# EAGLE design mainboard (EAGLE 8.1.1)
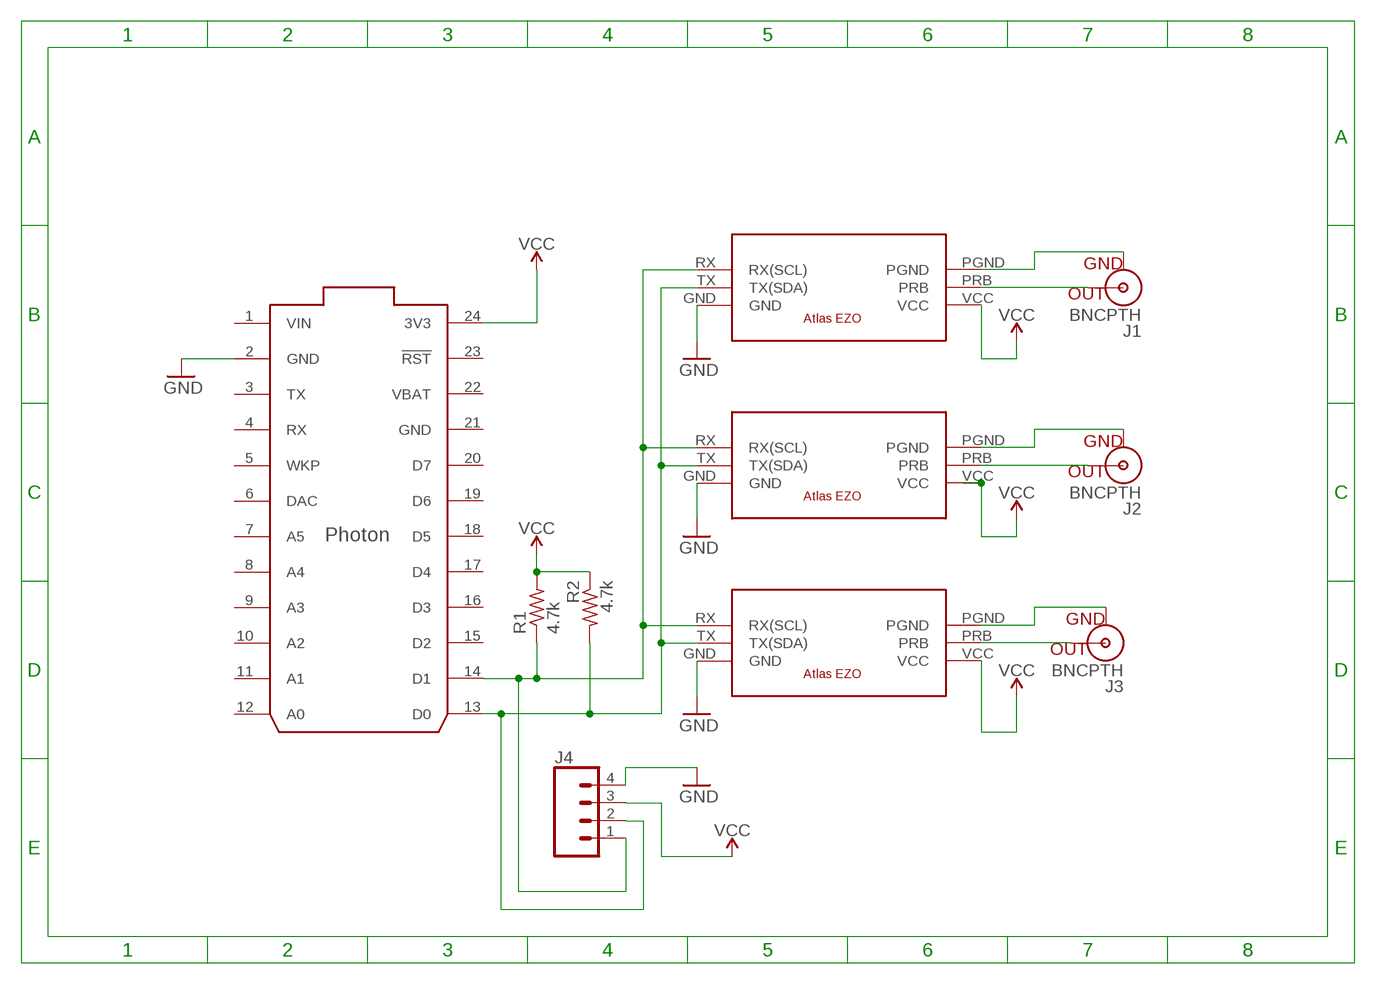
[diagram p0: schematic, sheet 1]

## Parts
J1  BNCPTH  [BNC]
J2  BNCPTH  [BNC]
J3  BNCPTH  [BNC]
J4  CONN_04  [1X04]
R1  4.7k  R-US_0207/7  [0207/7]
R2  4.7k  R-US_0207/7  [0207/7]
U$1  PHOTON_SMD  [PHOTON_SMD]
U$2  ATLSCI_EZO  [ATLAS_SCI_EZO]
U$3  ATLSCI_EZO  [ATLAS_SCI_EZO]
U$4  ATLSCI_EZO  [ATLAS_SCI_EZO]

## Nets
GND: J4.4 U$1.2(GND) U$2.GND U$3.GND U$4.GND
N$2: J4.1 R1.1 U$1.14(D1) U$2.RX(RX(SCL)) U$3.RX(RX(SCL)) U$4.RX(RX(SCL))
N$3: J4.2 R2.2 U$1.13(D0) U$2.TX(TX(SDA)) U$3.TX(TX(SDA)) U$4.TX(TX(SDA))
N$7: J2.S(OUT) U$3.PRB
N$8: J2.GND U$3.PGND
N$9: J1.S(OUT) U$2.PRB
N$10: J1.GND U$2.PGND
N$11: J3.S(OUT) U$4.PRB
N$12: J3.GND U$4.PGND
VCC: J4.3 R1.2 R2.1 U$1.24(3V3) U$2.VCC U$3.VCC U$4.VCC
Unconnected: U$1.3(TX) U$1.4(RX) U$1.5(WKP) U$1.6(DAC) U$1.7(A5) U$1.8(A4) U$1.9(A3) U$1.10(A2) U$1.11(A1) U$1.12(A0) U$1.15(D2) U$1.16(D3) U$1.17(D4) U$1.18(D5) U$1.19(D6) U$1.20(D7) U$1.23(!RST) U$1.25(EN) U$1.26(!SETUP) U$1.27(RGB_RED) U$1.28(RGB_GREEN) U$1.29(RGB_BLUE) U$1.30(USB_D-) U$1.31(USB_D+)

## Power pins joined to a net without a drawn wire
GND: U$1.21(GND)
VBAT: U$1.22(VBAT)
VIN: U$1.1(VIN)

## Library data of the parts
J1-J3 = SparkFun-Connectors:BNC: BNC Right Angle Connector Mouser Part# 5227161 SparkFun Products: BNC Connector - Right Angle <https://www.sparkfun.com/products/10550>; PROD_ID: LPA-12729; SF_ID: PRT-10550
J4 = SparkFun-Connectors:CONN_04: Multi connection point. Often used as Generic Header-pin footprint for 0.1 inch spaced/style header connections On any of the 0.1 inch spaced packages, you can populate with these: Break Away Headers - Straight <https://www.sparkfun.com/products/116> (PRT-00116) Break Away Male Headers - Right Angle <https://www.sparkfun.com/products/553> (PRT-00553) Female Headers <https://www.sparkfun.com/products/115> (PRT-00115) Break Away Headers - Machine Pin <https://www.sparkfun.com/products/117> (PRT-00117) Break Away Female Headers - Swiss Machine Pin <https://www.sparkfun.com/products/743> (PRT-00743) For SCREWTERMINALS and SPRING TERMINALS visit here: Screw Terimnals on SparkFun.com <https://www.sparkfun.com/search/results?term=Screw+Terminals> (5mm/3.5mm/2.54mm spacing) This device is also useful as a general connection point to wire up your design to another part of your project. Our various solder wires solder well into these plated through hole pads. Hook-Up Wire - Assortment (Stranded, 22 AWG) <https://www.sparkfun.com/products/11375> (PRT-11375) Hook-Up Wire - Assortment (Solid Core, 22 AWG) <https://www.sparkfun.com/products/11367> (PRT-11367) View the entire wire category on our website here <https://www.sparkfun.com/categories/141> Special notes: Molex polarized connector foot print use with SKU : PRT-08231 with associated crimp pins and housings. 1MM SMD Version SKU: PRT-10208; PROD_ID: CONN-09696
R1 R2 = rcl:R-US_: RESISTOR, American symbol
U$1 = Spark:PHOTON_SMD: Photon (without headers) - designed to be surface mounted with 7 extra exposed pads on the bottom of the board which include, 3 RGB LED outputs, /SETUP, EN (3.3V SMPS enable input), USB D+ and USB D-.
U$2-U$4 = cond:ATLSCI_EZO: Atlas Scientific EZO module

## Board
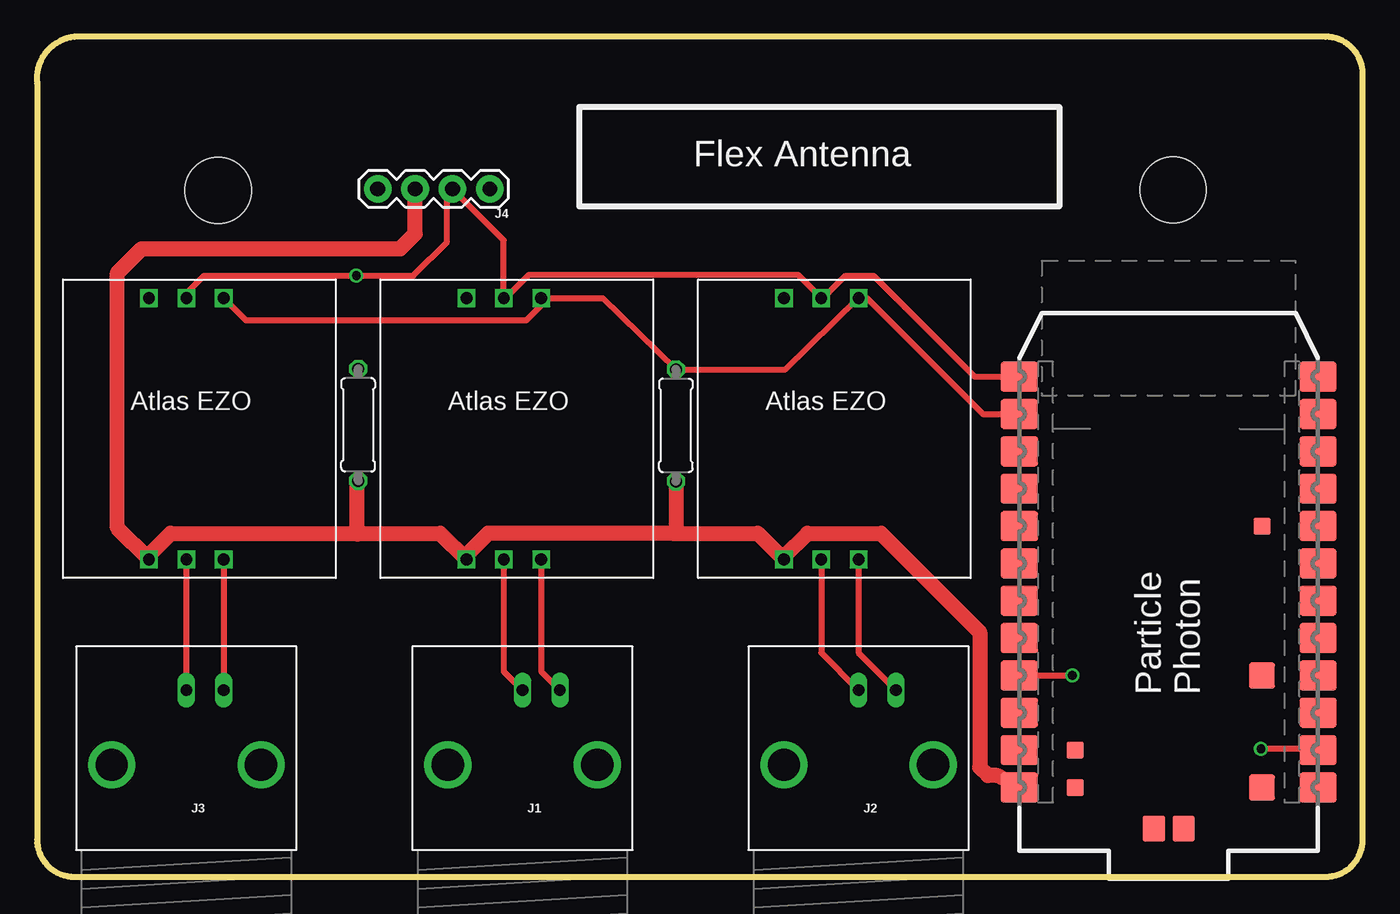
[diagram p1: board, top side]
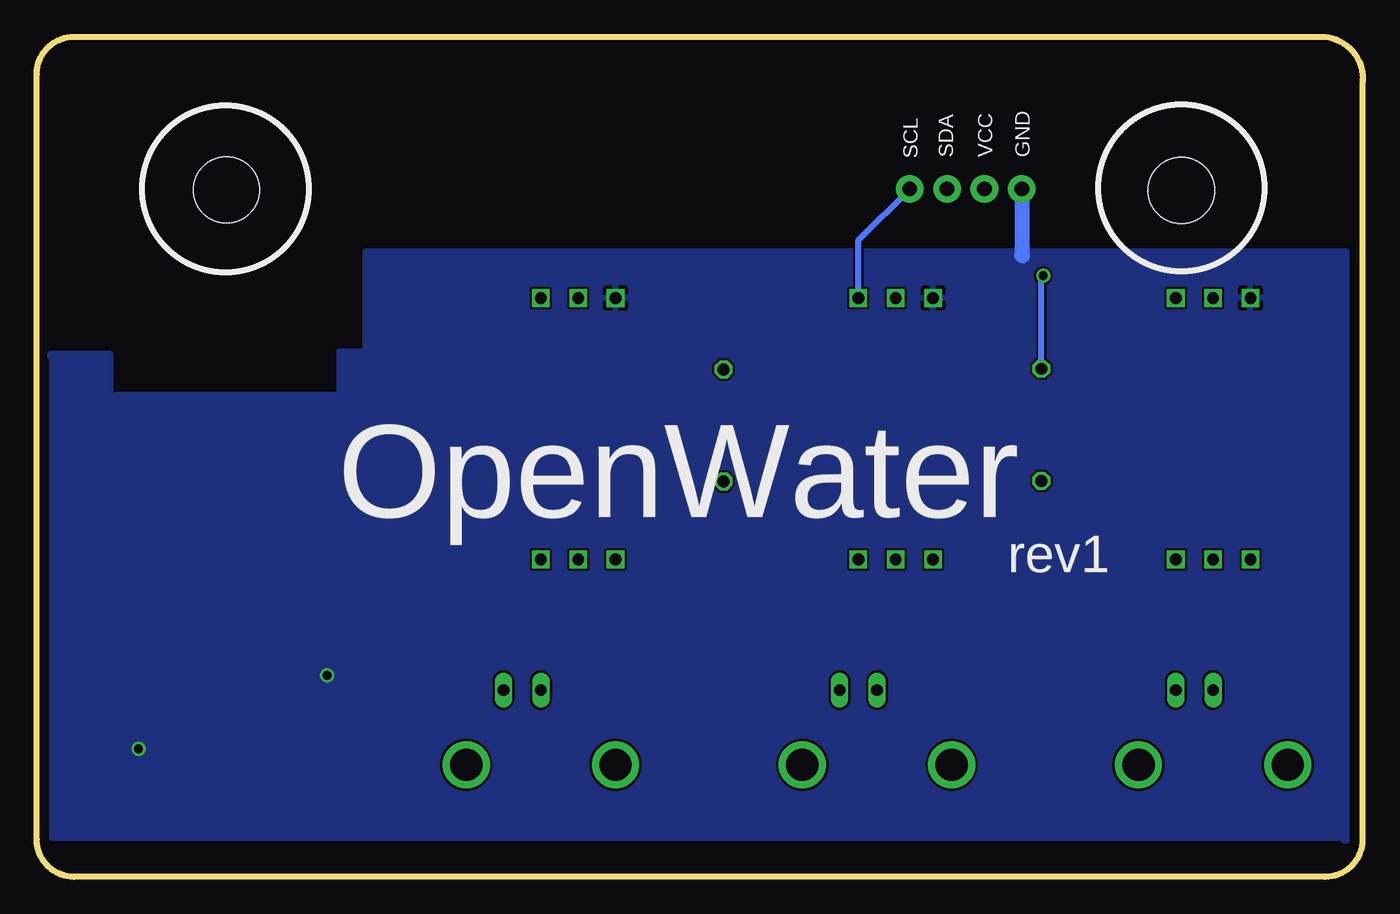
[diagram p2: board, bottom side, seen from below]

Size 90.19 x 57.15 mm. Coordinates in mm from the lower left corner, seen from the top.
Outline: 0.02,53.98 0.02,2.54 arc90 2.56,0 87.65,0 arc90 90.19,2.54 90.19,54.61 arc90 87.65,57.15 2.56,57.15 arc90 0.02,53.98
Copper layers (1*16): Top 0.0356mm / dielectric 1.5011mm / Bottom 0.0356mm
Design rules "LaenPCBOrder": minimum track width 6mil, minimum drill 13mil, track to track 6mil, track to pad 6mil, pad to pad 6mil, via to via 6mil, smd to smd 6mil, copper to edge 15mil, drill to drill 6mil, minimum pad ring 7mil, minimum via ring 7mil, stop-mask expansion 3mil, vias tented up to drill 0mil, thermal gap 10mil
Holes 4.5 mm at 12.34,46.7 77.3,46.73

### Footprints (pad centres in the part's own frame; a part is rotated, then mirrored left to right if it is on the bottom)
BNC = drill 2.2: 3 -5.08,5.08; 4 5.08,5.08 | drill 0.8 long: GND -2.54,0; S 0,0
1X04 = drill 1.016 pad 1.88: 1 0,0; 2 2.54,0; 3 5.08,0; 4 7.62,0
0207/7 = drill 0.813 octagon: 1 -3.81,0; 2 3.81,0
PHOTON_SMD = smd 2.54 x 2.032: 1 0,32.258; 2 0,29.718; 3 0,27.178; 4 0,24.638; 5 0,22.098; 6 0,19.558; 7 0,17.018; 8 0,14.478; 9 0,11.938; 10 0,9.398; 11 0,6.858; 12 0,4.318; 13 20.32,4.318; 14 20.32,6.858; 15 20.32,9.398; 16 20.32,11.938; 17 20.32,14.478; 18 20.32,17.018; 19 20.32,19.558; 20 20.32,22.098; 21 20.32,24.638; 22 20.32,27.178; 23 20.32,29.718; 24 20.32,32.258 | smd 1.778 x 1.778: 25 3.81,32.258; 26 3.81,24.638 | smd 1.143 x 1.143: 27 3.81,14.478; 28 16.51,29.718; 29 16.51,32.258 | smd 1.524 x 1.778: 30 11.176,35.052; 31 9.144,35.052
ATLAS_SCI_EZO = drill 0.8 square: GND -2.54,8.89; PGND 2.54,-8.89; PRB 0,-8.89; RX 2.54,8.89; TX 0,8.89; VCC -2.54,-8.89

### Placement (x,y rotation side)
J1  33.04,12.7 180 top
J2  55.9,12.7 180 top
J3  10.18,12.7 180 top
J4  30.81,46.8 180 top
R1  43.47,30.71 270 top
R2  21.86,30.75 90 top
U$1  87.15,38.34 180 top
U$2  31.77,30.48 0 top
U$3  53.36,30.48 0 top
U$4  10.18,30.48 0 top

### Tracks (layer width: path | path; a pad name or v marks a point on that pad's centre or on a via)
GND  (via drill 0.6)
  Top 0.406: 67.2,13.65 67.15,13.7 U$1.21 66.84,13.72 v70.44,13.72 | U$1.2 87.07,8.7 v83.27,8.7
  Bottom 1.016: J4.4 23.19,42.29 23.13,42.23
  pour Bottom: 89.17,2.67 1.29,2.67 1.29,2.48 1.1,2.48 1.1,42.55 67.84,42.55 67.84,35.75 69.61,35.75 69.61,32.77 84.85,32.77 84.85,31.94 85.17,31.94 85.17,35.56 89.3,35.56 89.3,35.37 89.17,35.37
N$2
  Top 0.406: U$1.14 64.36,31.48 56.47,39.37 U$3.RX 50.92,34.52 R1.1 38.5,39.37 U$2.RX 34.31,38.86 33.29,37.85 14.24,37.85 U$4.RX
  Bottom 0.406: U$2.RX 34.31,43.31 J4.1
N$3  (via drill 0.6)
  Top 0.406: 65.06,34.02 U$1.13 63.79,34.02 56.91,40.89 55.01,40.89 53.48,39.37 U$3.TX 51.77,40.96 33.48,40.96 31.89,39.37 U$2.TX 31.77,43.31 J4.2 27.89,46.42 27.89,43.18 25.61,40.89 v21.73,40.89 11.38,40.89 10.18,39.69 U$4.TX
  Bottom 0.406: R2.2 21.86,40.77 v21.73,40.89
N$7
  Top 0.406: U$3.PRB 53.36,15.24 J2.S
N$8
  Top 0.406: U$3.PGND 55.9,15.24 J2.GND
N$9
  Top 0.406: U$2.PRB 31.77,13.97 J1.S
N$10
  Top 0.406: J1.GND 34.31,13.97 U$2.PGND
N$11
  Top 0.406: U$4.PRB J3.S
N$12
  Top 0.406: U$4.PGND J3.GND
VCC
  Top 1.016: U$1.24 65.31,6.89 64.68,6.89 64.15,7.43 64.15,16.64 57.42,23.37 52.41,23.37 50.82,21.78 U$3.VCC 49.04,23.37 43.2,23.37 | 21.73,23.37 9.1,23.37 7.64,21.91 U$4.VCC 5.48,23.75 5.48,41.08 7.13,42.74 24.72,42.74 25.74,43.75 J4.3 | 21.73,23.37 21.8,23.3 21.8,26.88 R2.1 | 21.73,23.37 27.45,23.37 U$2.VCC 29.23,21.91 30.69,23.37 43.2,23.37 | R1.2 43.47,23.45 43.2,23.37

### Text on the board
tPlace: Flex Antenna | Particle / Photon
bPlace: GND | VCC | SDA | SCL | OpenWater | rev1